# Altium schematic sheet Peripherals.SchDoc
size A4; SheetNumber: 3; SheetTotal: 4
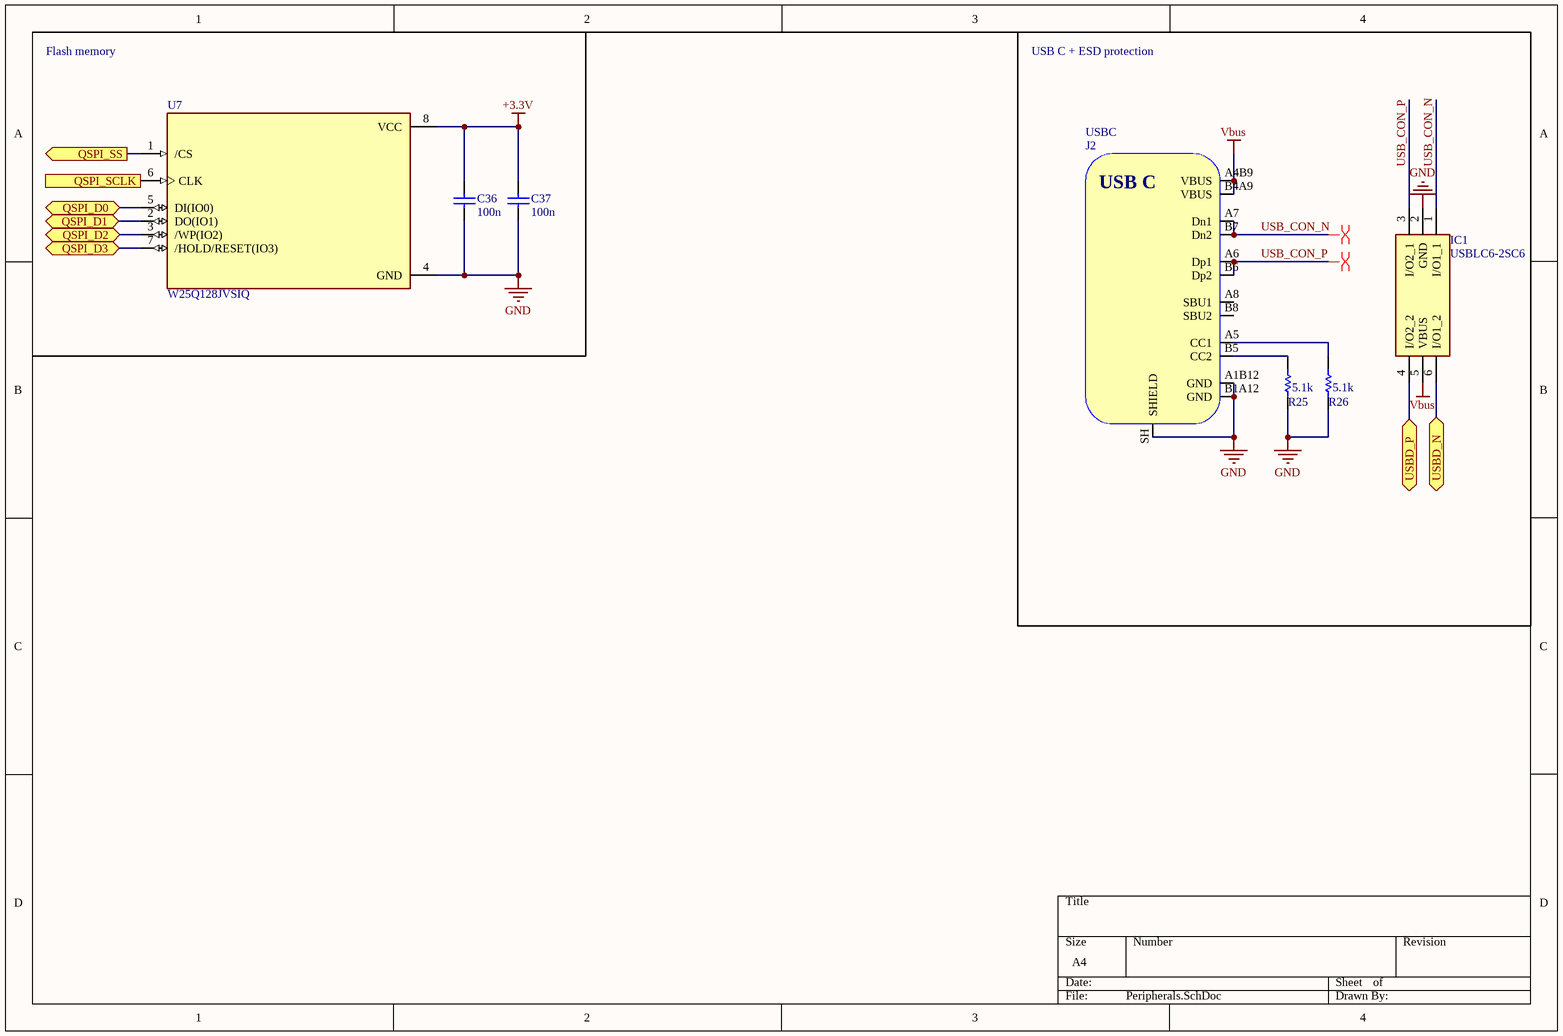
[diagram p0: Peripherals.SchDoc]

## Parts
C36  value 100n  [RES_0805]  (hidden comment: Capacitor)
C37  value 100n  [RES_0805]  (hidden comment: Capacitor)
IC1  USBLC6-2SC6  [SOT95P280X145-6N]
J2  USB4105-GF-A-060  [USB4105-GF-A-060]  (value not drawn)
R25  value 5.1k  [RES_0805]  (hidden comment: Resistor)
R26  value 5.1k  [RES_0805]  (hidden comment: Resistor)
U7  W25Q128JVSIQ  [SOIC127P790X216-8N]

## Ports
QSPI_D0 (bidir, see MCU[1D]), QSPI_D1 (bidir, see MCU[1D]), QSPI_D2 (bidir, see MCU[1D]), QSPI_D3 (bidir, see MCU[1D]), QSPI_SCLK (out, see MCU[1D]), QSPI_SS (out, see MCU[1D]), USBD_N (bidir, see MCU[1D]), USBD_P (bidir, see MCU[1D])

## Nets
+3.3V: C36.1 C37.1 U7.8(VCC)
GND: C36.2 C37.2 IC1.2(GND) J2.A1B12(GND) J2.B1A12(GND) J2.SH(SHIELD) R25.2 R26.2 U7.4(GND)
Vbus: IC1.5(VBUS) J2.A4B9(VBUS) J2.B4A9(VBUS)
QSPI_D0: U7.5(DI(IO0)) ; port QSPI_D0
QSPI_D1: U7.2(DO(IO1)) ; port QSPI_D1
QSPI_D2: U7.3(/WP(IO2)) ; port QSPI_D2
QSPI_D3: U7.7(/HOLD/RESET(IO3)) ; port QSPI_D3
QSPI_SCLK: U7.6(CLK) ; port QSPI_SCLK
QSPI_SS: U7.1(/CS) ; port QSPI_SS
USB_CON_N: IC1.1(I/O1_1) J2.A7(Dn1) J2.B7(Dn2)
USB_CON_P: IC1.3(I/O2_1) J2.A6(Dp1) J2.B6(Dp2)
USBD_N: IC1.6(I/O1_2) ; port USBD_N
USBD_P: IC1.4(I/O2_2) ; port USBD_P
NetJ2_A5: J2.A5(CC1) R26.1
NetJ2_B5: J2.B5(CC2) R25.1

Not connected (* = marked no-connect by the designer): J2 A8(SBU1) B8(SBU2)

## Layout directives
differential pair: USB_CON_N, USB_CON_P

## Notes on the sheet
- Flash memory
- USB C + ESD protection
- USBC
- (in symbol USB4105-GF-A-060) USB C

## Library data of the parts
C36 C37 = Capacitor: SimulationGenericComponent: True
IC1 = USBLC6-2SC6: Integrated Circuit; Manufacturer_Name: STMicroelectronics; Datasheet Link: http://www.st.com/st-web-ui/static/active/en/resource/technical/document/datasheet/CD00050750.pdf; Height: 1.45mm; Manufacturer_Part_Number: USBLC6-2SC6; Mouser Part Number: 511-USBLC6-2SC6; Mouser Price/Stock: https://www.mouser.co.uk/ProductDetail/STMicroelectronics/USBLC6-2SC6?qs=po45yt2pPpu%2FhNIlwQdTlg%3D%3D; Arrow Part Number: USBLC6-2SC6; Arrow Price/Stock: https://www.arrow.com/en/products/usblc6-2sc6/stmicroelectronics?utm_currency=USD&region=europe
J2 = USB4105-GF-A-060: USB Connector Type C SMT 12 Pin; Manufacturer: GCT; Manufacturer Part Number: USB4105-GF-A-060; Distributor Link: https://eu.mouser.com/ProductDetail/GCT/USB4105-GF-A-060?qs=QNEnbhJQKvY2mocwNJzgfA%3D%3D
R25 R26 = Resistor: TC1: 0; SimulationGenericComponent: True; TC2: 0
U7 = W25Q128JVSIQ: FLASH - NOR Memory IC 128Mb (16M x 8) SPI - Quad I/O, QPI, DTR 133 MHz 8-SOIC; MF: Winbond Electronics; SnapEDA_Link: https://www.snapeda.com/parts/W25Q128JVSIQ/Winbond/view-part/?ref=snap; Package: SOIC-8 Winbond Electronics; Value: *; MP: W25Q128JVSIQ; Check_prices: https://www.snapeda.com/parts/W25Q128JVSIQ/Winbond/view-part/?ref=eda